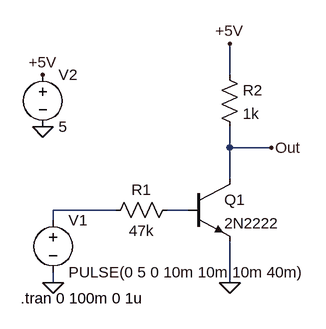
[diagram p0: schematic RTL.asc]
RTL.asc, the LTspice schematic file:
Version 4
SHEET 1 880 680
WIRE 176 -64 176 -112
WIRE 176 48 176 16
WIRE 240 48 176 48
WIRE 176 96 176 48
WIRE 0 144 -96 144
WIRE 112 144 80 144
WIRE -96 160 -96 144
WIRE -96 256 -96 240
WIRE 176 256 176 192
FLAG 176 256 0
FLAG 176 -112 +5V
FLAG 240 48 Out
FLAG -96 256 0
FLAG -112 16 0
FLAG -112 -64 +5V
SYMBOL res 96 128 R90
WINDOW 0 0 56 VBottom 2
WINDOW 3 32 56 VTop 2
SYMATTR InstName R1
SYMATTR Value 47k
SYMBOL npn 112 96 R0
SYMATTR InstName Q1
SYMATTR Value 2N2222
SYMBOL res 160 -80 R0
SYMATTR InstName R2
SYMATTR Value 1k
SYMBOL voltage -96 144 R0
WINDOW 123 0 0 Left 0
WINDOW 39 0 0 Left 0
SYMATTR InstName V1
SYMATTR Value PULSE(0 5 0 10m 10m 10m 40m)
SYMBOL voltage -112 -80 R0
WINDOW 123 0 0 Left 0
WINDOW 39 0 0 Left 0
SYMATTR InstName V2
SYMATTR Value 5
TEXT -146 280 Left 2 !.tran 0 100m 0 1u

The netlist it stands for:
* RTL.asc
R1 N002 N001 47k
Q1 Out N002 0 0 2N2222
R2 +5V Out 1k
V1 N001 0 PULSE(0 5 0 10m 10m 10m 40m)
V2 +5V 0 5
.model NPN NPN
.model PNP PNP
.lib standard.bjt
.tran 0 100m 0 1u
.backanno
.end